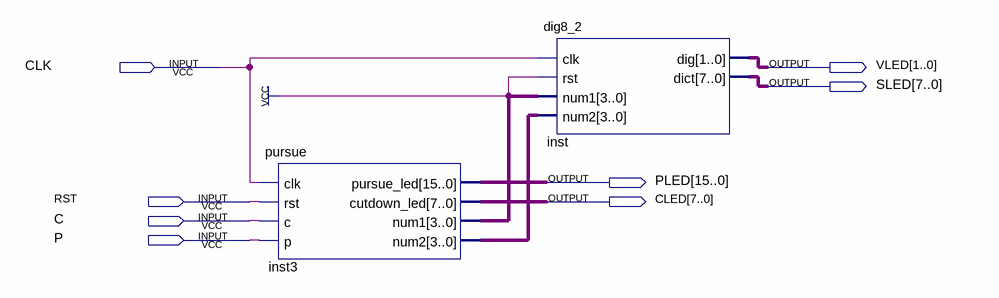
[diagram p0: schematic sheet]
// Quartus schematic lab9_3.bdf as structural Verilog: 2 symbols, 8 pins
module lab9_3 (
  input  CLK,
  input  RST,
  input  C,
  input  P,
  output [1:0] VLED,
  output [7:0] SLED,
  output [15:0] PLED,
  output [7:0] CLED
);

  wire [3:0] inst3_num1, inst3_num2;

  pursue inst3 (
    .clk(CLK), .rst(RST), .c(C), .p(P), .pursue_led(PLED), .cutdown_led(CLED), .num1(inst3_num1),
    .num2(inst3_num2));
  dig8_2 inst (.clk(CLK), .rst(1'b1), .num1(inst3_num1), .num2(inst3_num2), .dig(VLED), .dict(SLED));
endmodule
